# EAGLE design JKF_1_0 (EAGLE 8.3.2)
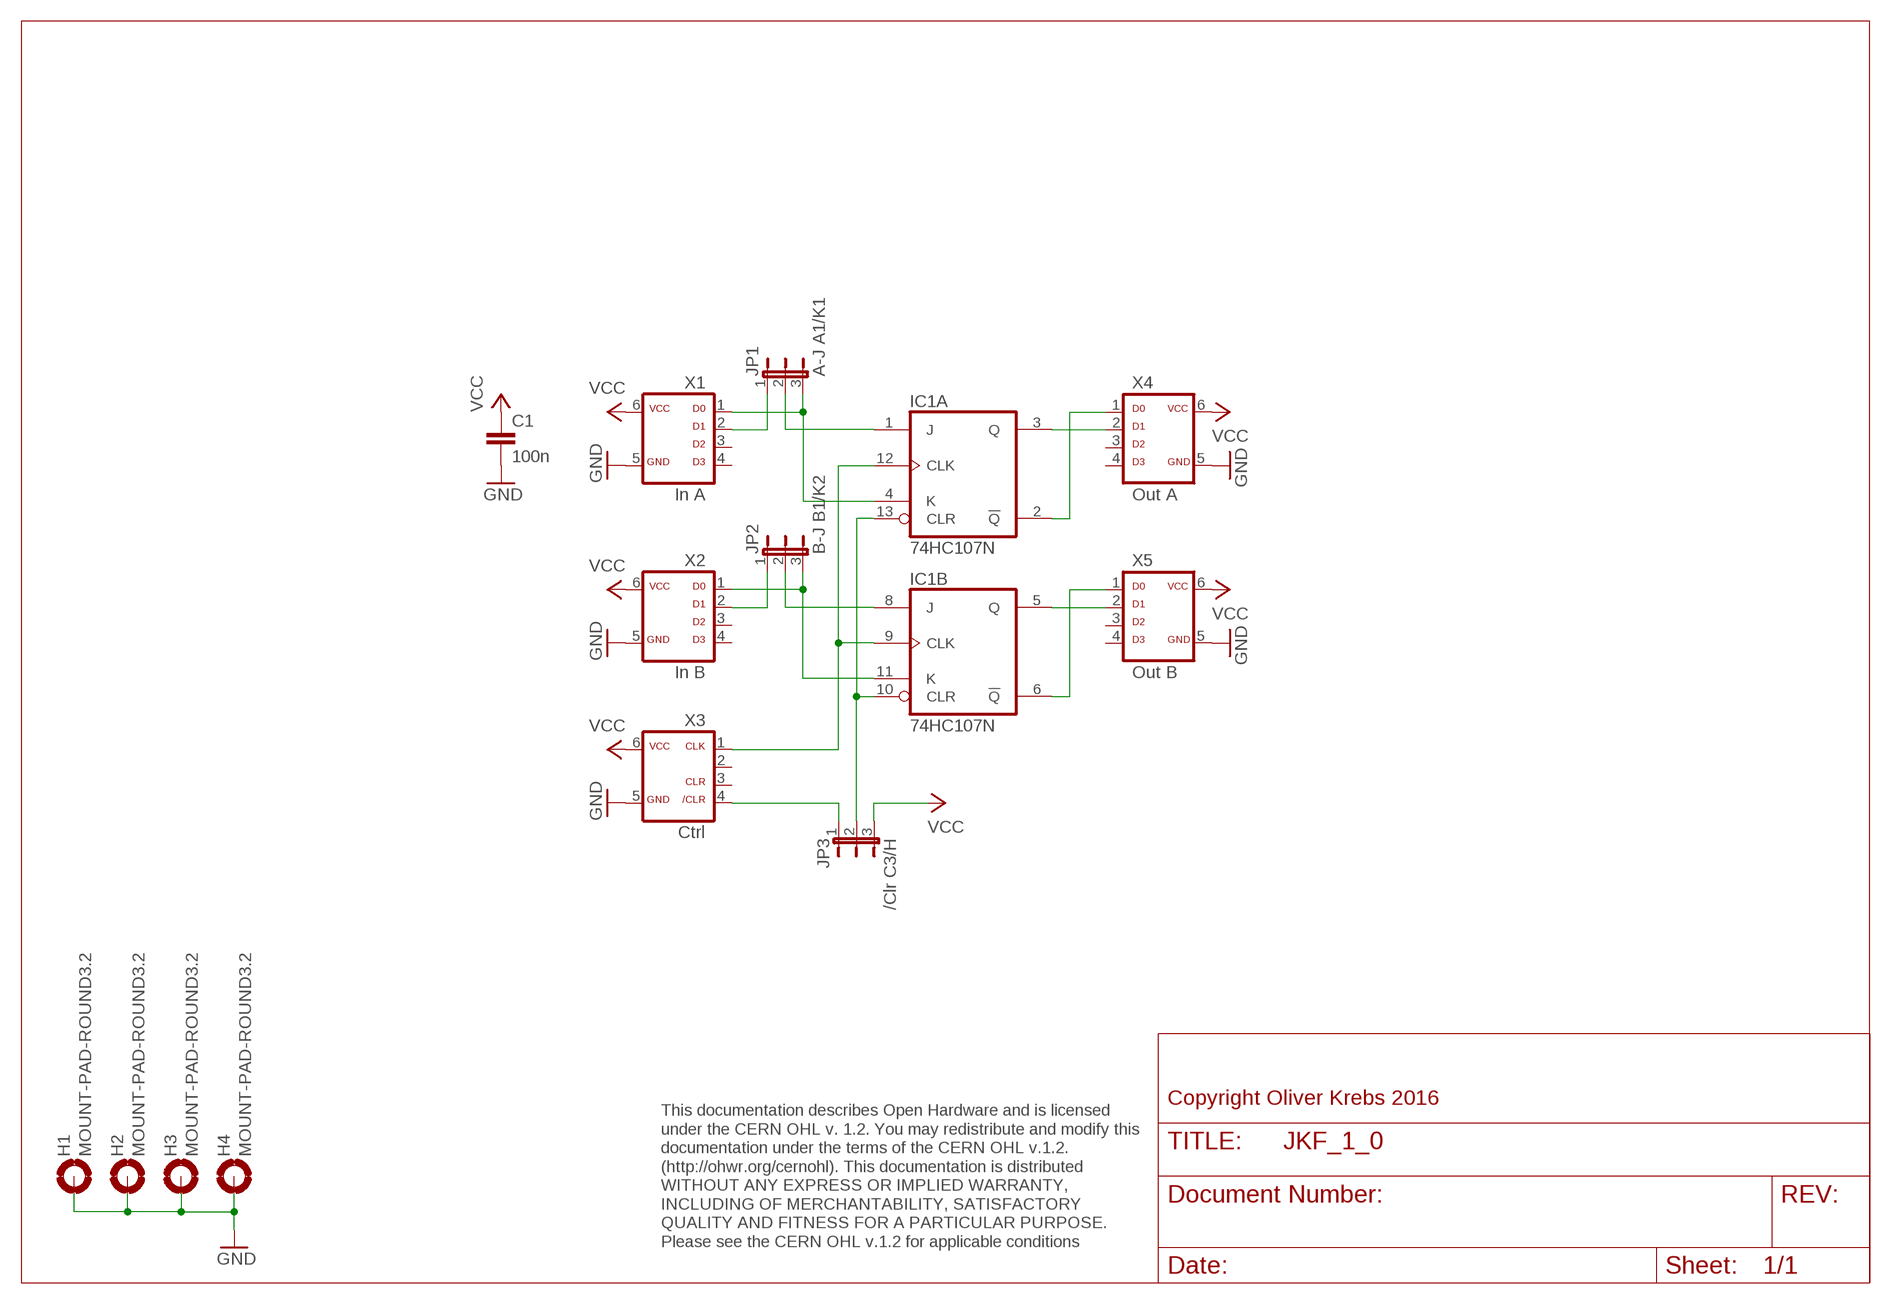
[diagram p0: schematic, sheet 1]

## Parts
C1  100n  C-EU050-025X075  [C050-025X075]
H1  MOUNT-PAD-ROUND3.2  [3,2-PAD]
H2  MOUNT-PAD-ROUND3.2  [3,2-PAD]
H3  MOUNT-PAD-ROUND3.2  [3,2-PAD]
H4  MOUNT-PAD-ROUND3.2  [3,2-PAD]
IC1  74HC107N  [DIL14]
JP1  A-J A1/K1  JP2E  [JP2]
JP2  B-J B1/K2  JP2E  [JP2]
JP3  /Clr C3/H  JP2E  [JP2]
X1  In A  ML6D  [ML-6]
X2  In B  ML6D  [ML-6]
X3  Ctrl  ML6C  [ML-6]
X4  Out A  ML6D  [ML-6]
X5  Out B  ML6D  [ML-6]

## Nets
GND: C1.2 H1.B3,2(MOUNT) H2.B3,2(MOUNT) H3.B3,2(MOUNT) H4.B3,2(MOUNT) X1.5 X2.5 X3.5 X4.5 X5.5
N$1: IC1.4(A:K) JP1.3 X1.1
N$2: JP3.1 X3.4
N$3: IC1.9(B:CLK) IC1.12(A:CLK) X3.1
N$4: IC1.10(B:CLR) IC1.13(A:CLR) JP3.2
N$5: IC1.11(B:K) JP2.3 X2.1
N$7: IC1.2(A:!Q) X4.1
N$8: IC1.3(A:Q) X4.2
N$9: IC1.6(B:!Q) X5.1
N$10: IC1.5(B:Q) X5.2
N$11: IC1.8(B:J) JP2.2
N$12: IC1.1(A:J) JP1.2
N$13: JP2.1 X2.2
N$14: JP1.1 X1.2
VCC: C1.1 JP3.3 X1.6 X2.6 X3.6 X4.6 X5.6
Unconnected: X1.3 X1.4 X2.3 X2.4 X3.2 X3.3 X4.3 X4.4 X5.3 X5.4

## Notes on the sheet
- Copyright Oliver Krebs 2016
- This documentation describes Open Hardware and is licensed 
  under the CERN OHL v. 1.2. You may redistribute and modify this 
  documentation under the terms of the CERN OHL v.1.2. 
  (http://ohwr.org/cernohl). This documentation is distributed
  WITHOUT ANY EXPRESS OR IMPLIED WARRANTY, 
  INCLUDING OF MERCHANTABILITY, SATISFACTORY 
  QUALITY AND FITNESS FOR A PARTICULAR PURPOSE. 
  Please see the CERN OHL v.1.2 for applicable conditions

## Power pins joined to a net without a drawn wire
GND: IC1.7(P:GND)
VCC: IC1.14(P:VCC)

## Library data of the parts
C1 = 01-my_rcl:C-EU: CAPACITOR, European symbol
H1-H4 = holes:MOUNT-PAD-ROUND: MOUNTING PAD, round
IC1 = 74xx-eu:74*107: Dual J-K FLIP FLOP, clear
JP1-JP3 = jumper:JP2E: JUMPER
X1 X2 X4 X5 = 01-my-con:ML6D
X3 = 01-my-con:ML6C

## Board
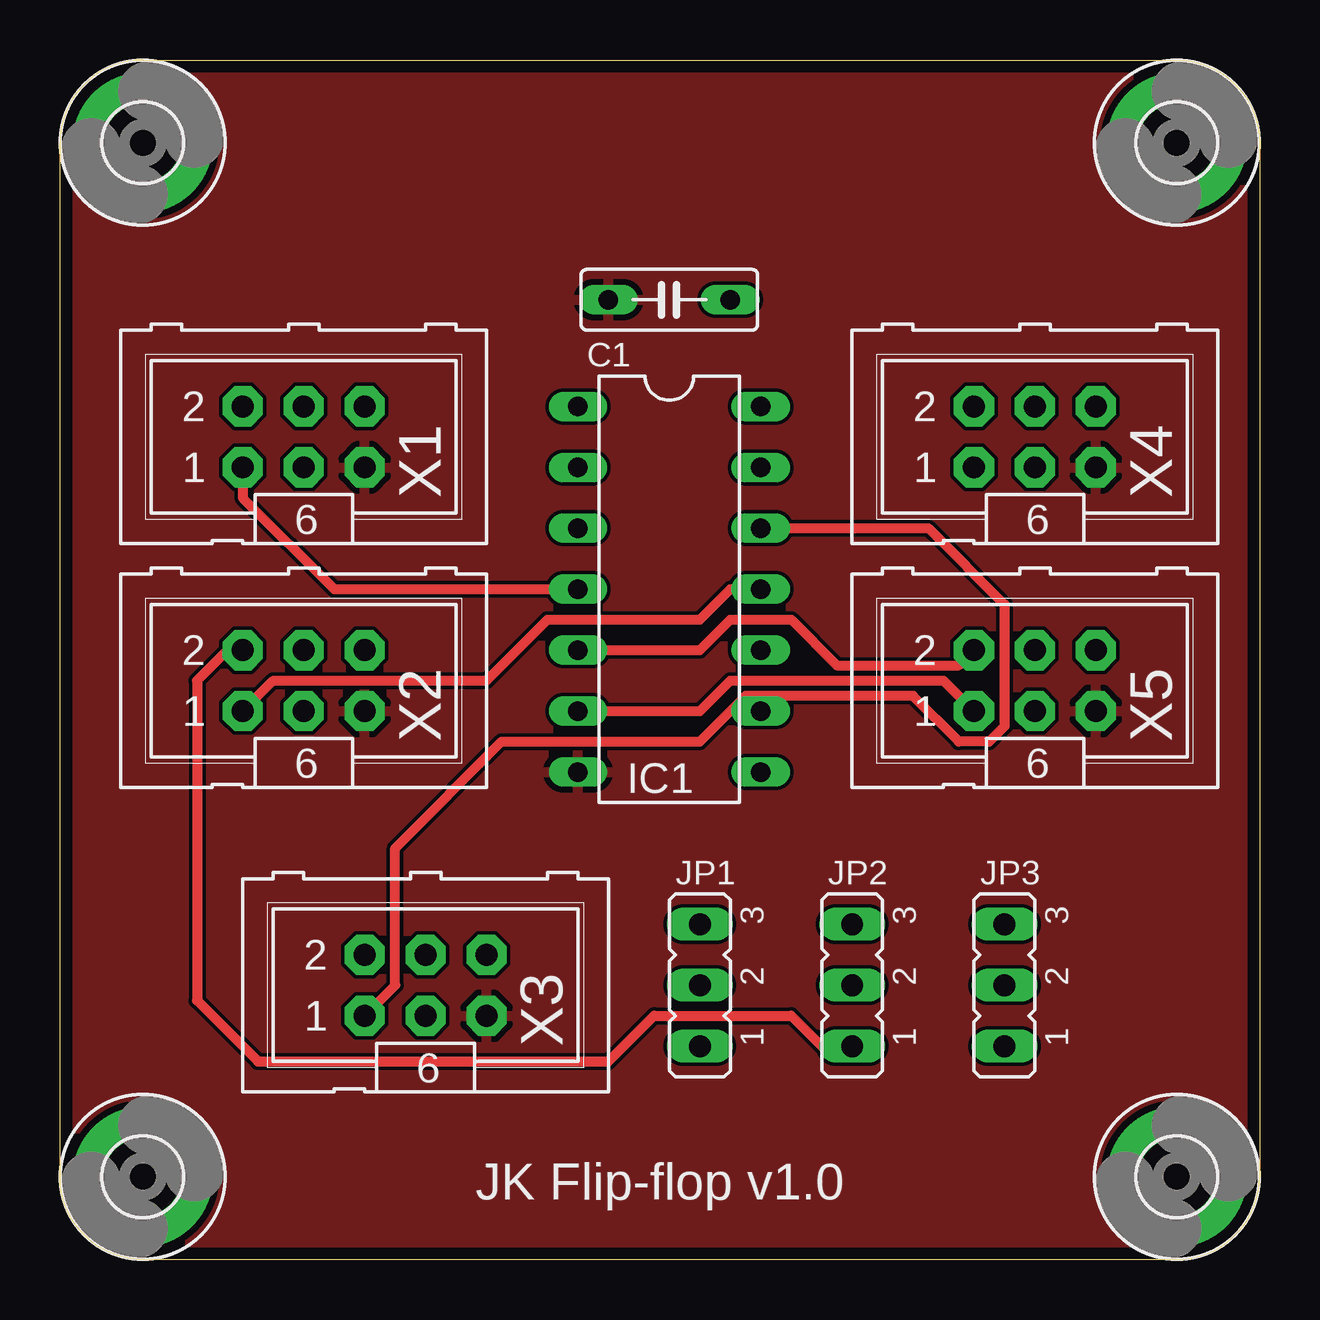
[diagram p1: board, top side]
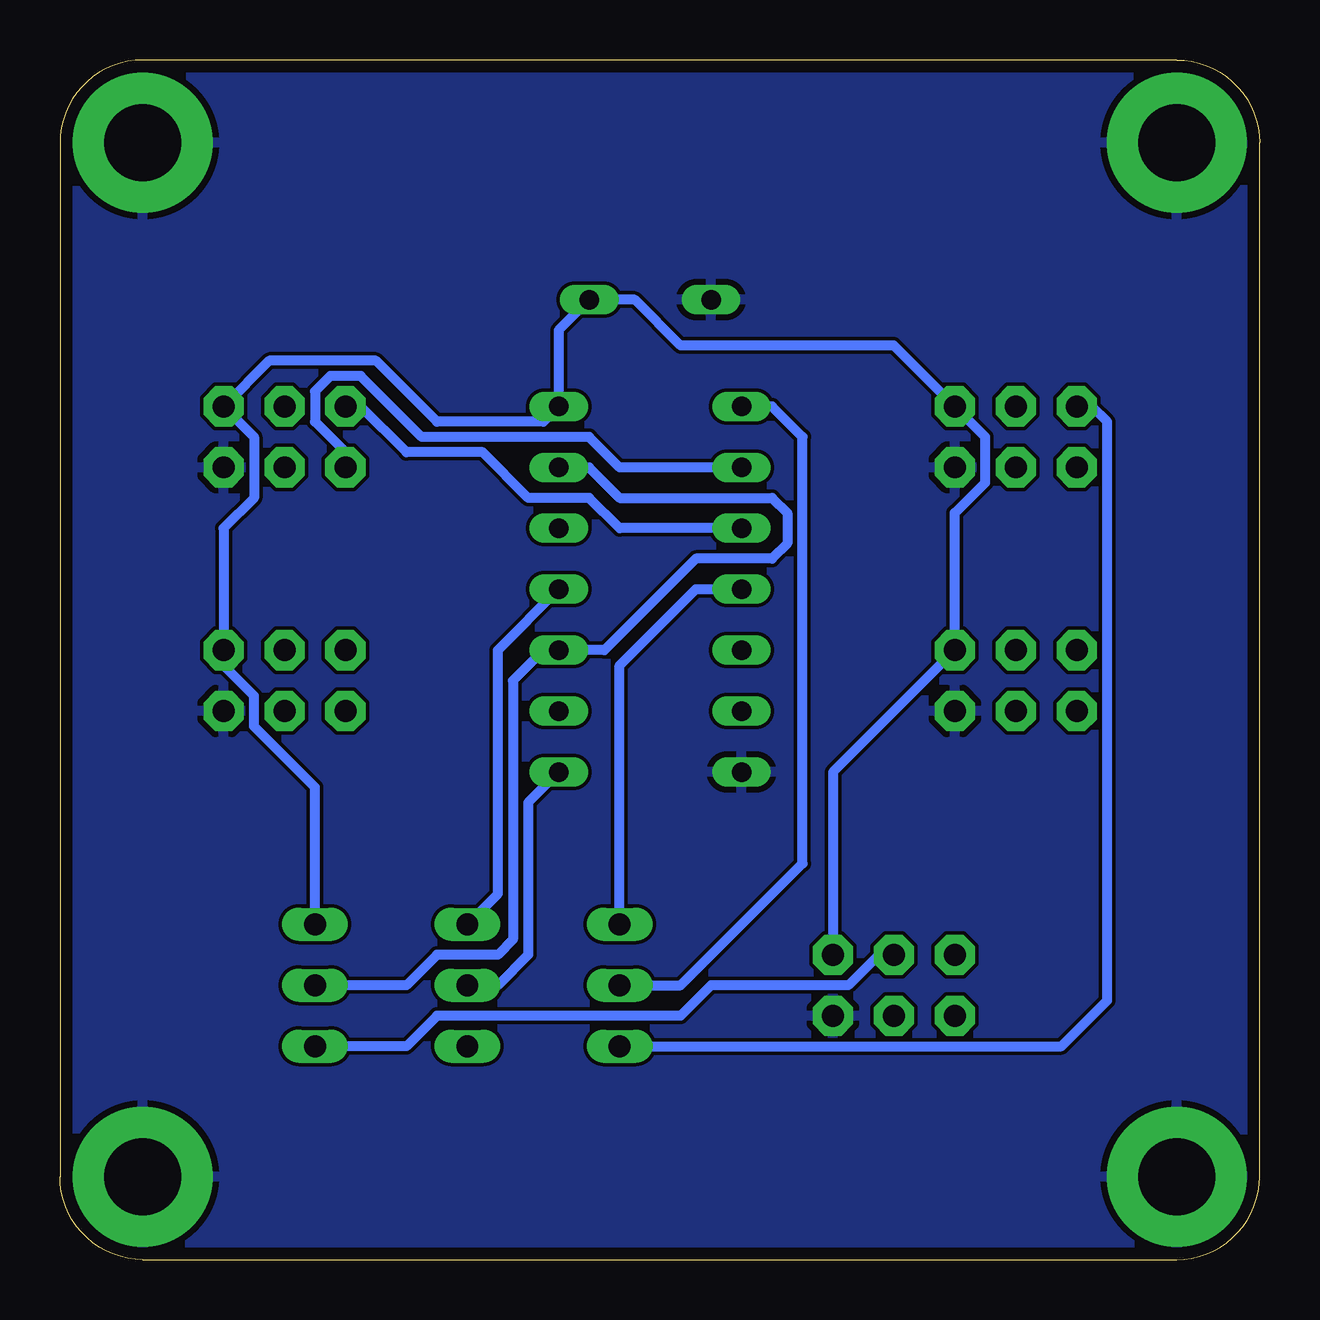
[diagram p2: board, bottom side, seen from below]

Size 50 x 50 mm. Coordinates in mm from the lower left corner, seen from the top.
Outline: 0,3.45 0,46.55 arc-90 3.45,50 46.55,50 arc-90 50,46.55 50,3.45 arc-90 46.55,0 3.45,0 arc-90 0,3.45
Copper layers (1*16): Top 0.035mm / dielectric 1.6mm / Bottom 0.035mm
Design rules "Elecrow_2-layer_PCB_eagle_rule": minimum track width 6mil, minimum drill 12mil, track to track 6mil, track to pad 6mil, pad to pad 6mil, via to via 8mil, smd to smd 0mil, copper to edge 20mil, drill to drill 10mil, minimum pad ring 6mil, minimum via ring 6mil, stop-mask expansion 0mil, vias tented up to drill 100mil, thermal gap 10mil

### Footprints (pad centres in the part's own frame; a part is rotated, then mirrored left to right if it is on the bottom)
C050-025X075 = drill 0.813 long: 1 -2.54,0; 2 2.54,0
3,2-PAD = drill 3.2 pad 5.842: B3,2 0,0
DIL14 = drill 0.813 long: 1 -7.62,-3.81; 2 -5.08,-3.81; 3 -2.54,-3.81; 4 0,-3.81; 5 2.54,-3.81; 6 5.08,-3.81; 7 7.62,-3.81; 8 7.62,3.81; 9 5.08,3.81; 10 2.54,3.81; 11 0,3.81; 12 -2.54,3.81; 13 -5.08,3.81; 14 -7.62,3.81
JP2 = drill 0.914 long: 1 -2.54,0; 2 0,0; 3 2.54,0
ML-6 = drill 0.914 pad 1.676 octagon: 1 -2.54,-1.27; 2 -2.54,1.27; 3 0,-1.27; 4 0,1.27; 5 2.54,-1.27; 6 2.54,1.27

### Placement (x,y rotation side)
C1  25.4,40.01 180 top
H1  3.45,3.45 0 top
H2  3.45,46.55 0 top
H3  46.55,3.45 0 top
H4  46.55,46.55 0 top
IC1  25.4,27.94 270 top
JP1  26.67,11.43 90 top
JP2  33.02,11.43 90 top
JP3  39.37,11.43 90 top
X1  10.16,34.29 0 top
X2  10.16,24.13 0 top
X3  15.24,11.43 0 top
X4  40.64,34.29 0 top
X5  40.64,24.13 0 top

### Tracks (layer width: path | path; a pad name or v marks a point on that pad's centre or on a via)
GND
  pour Bottom: -0.17,0 -0.17,50.16 50,50.16 50,0
  pour Top: -0.17,0 -0.17,50.16 50,50.16 50,0
N$1
  Top 0.406: X1.1 7.62,31.75 11.43,27.94 IC1.4
  Bottom 0.406: JP1.3 26.67,24.77 23.5,27.94 IC1.4
N$2
  Bottom 0.406: X3.4 15.88,12.7 17.14,11.43 22.86,11.43 24.13,10.16 34.29,10.16 35.56,8.89 JP3.1
N$3
  Top 0.406: X3.1 13.97,11.43 13.97,17.14 18.41,21.59 26.67,21.59 28.57,23.5 29.21,23.5 | IC1.12 36.2,30.48 39.37,27.3 39.37,22.23 38.73,21.59 37.47,21.59 35.56,23.5 29.21,23.5 | IC1.9 29.21,23.5
N$4
  Bottom 0.406: JP3.2 35.56,11.43 34.29,12.7 31.75,12.7 31.11,13.34 31.11,24.13 29.84,25.4 IC1.10 27.3,25.4 23.5,29.21 20.32,29.21 19.68,29.84 19.68,31.11 20.32,31.75 26.67,31.75 27.94,33.02 IC1.13
N$5
  Top 0.406: X2.1 8.89,24.13 17.78,24.13 20.32,26.67 26.67,26.67 27.94,27.94 IC1.11
  Bottom 0.406: JP2.3 31.75,15.24 31.75,25.4 IC1.11
N$7
  Bottom 0.406: IC1.2 26.67,33.02 27.94,34.29 34.92,34.29 37.47,36.83 38.73,36.83 39.37,36.2 39.37,34.92 38.1,33.66 X4.1
N$8
  Bottom 0.406: IC1.3 26.67,30.48 27.94,31.75 30.48,31.75 32.38,33.66 35.56,33.66 37.47,35.56 X4.2
N$9
  Top 0.406: IC1.6 26.67,22.86 27.94,24.13 36.83,24.13 X5.1
N$10
  Top 0.406: IC1.5 26.67,25.4 27.94,26.67 30.48,26.67 32.38,24.77 37.47,24.77 X5.2
N$11
  Bottom 0.406: JP2.2 31.75,11.43 30.48,12.7 30.48,19.05 IC1.8
N$12
  Bottom 0.406: JP1.2 24.13,11.43 19.05,16.51 19.05,34.29 20.32,35.56 IC1.1
N$13
  Top 0.406: X2.2 6.99,25.4 5.71,24.13 5.71,10.79 8.26,8.26 22.86,8.26 24.77,10.16 30.48,10.16 31.75,8.89 JP2.1
N$14
  Bottom 0.406: JP1.1 8.26,8.89 6.35,10.79 6.35,34.92 6.99,35.56 X1.2
VCC
  Bottom 0.406: X3.6 17.78,20.32 X2.6 12.7,31.11 11.43,32.38 11.43,34.29 X1.6 15.24,38.1 24.13,38.1 26.04,40.01 C1.1 29.21,38.73 IC1.14 29.84,34.92 34.29,34.92 36.83,37.47 41.27,37.47 X4.6 41.91,34.29 41.91,31.75 43.18,30.48 X5.6 43.18,24.77 41.91,23.5 41.91,22.23 39.37,19.68 JP3.3

### Text on the board
tNames: JK Flip-flop v1.0
200bmp: E:/Bilder/Elektronik/Modulion/Mexdulon/mexdulon_50x50_pcb.bmp